# EAGLE design iss_camtag_v2_4 (EAGLE 9.4.2)
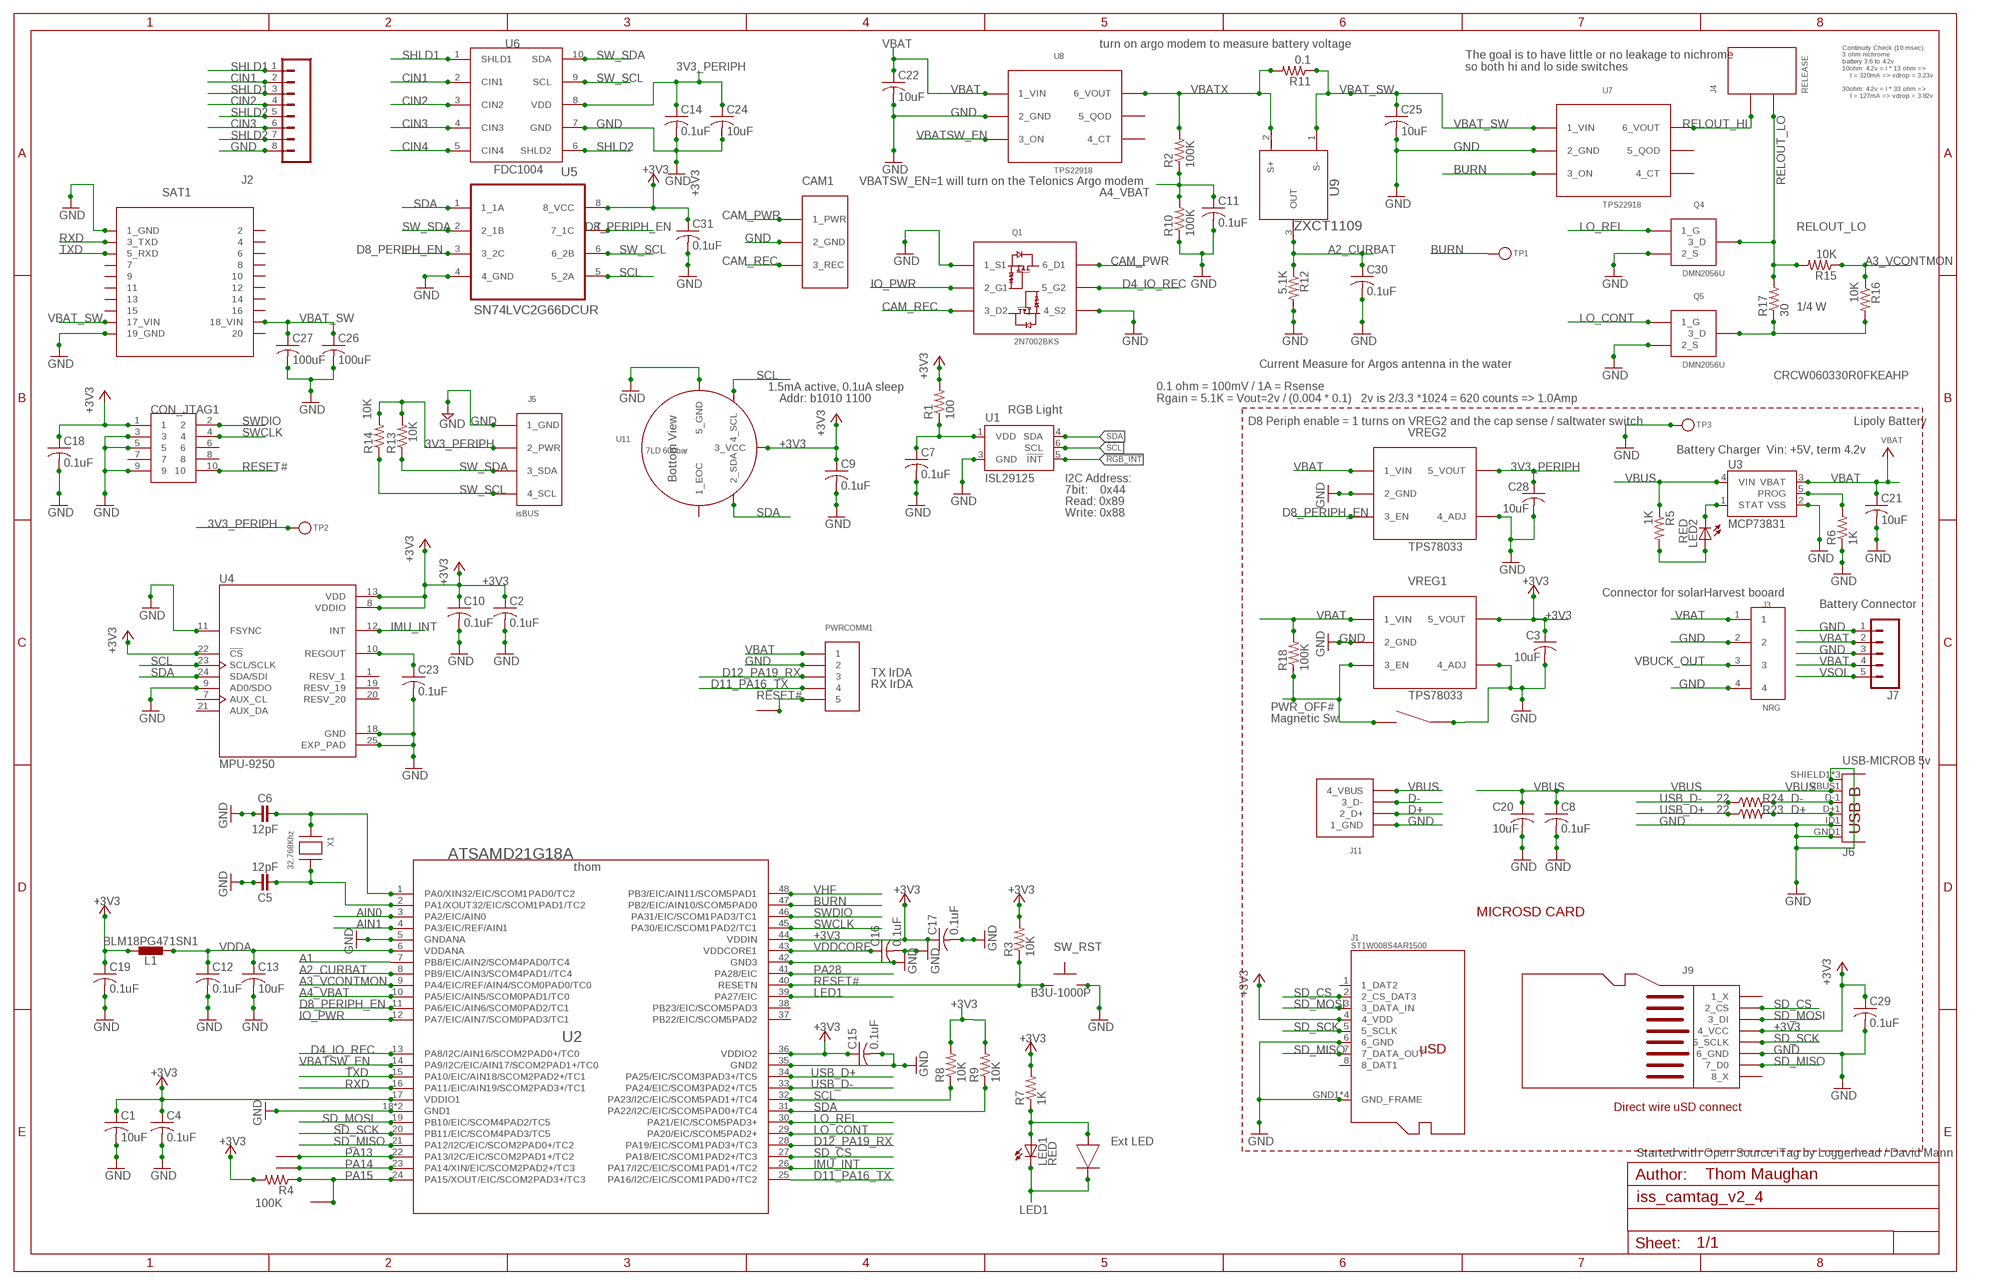
[diagram p0: schematic, sheet 1]

## Parts
C1  10uF  C-USC0603  [C0603]
C2  0.1uF  C-USC0402  [C0402]
C3  10uF  C-USC0603K  [C0603K]
C4  0.1uF  C-USC0402  [C0402]
C5  12pF  CAPACITORS-0402  [C0402]
C6  12pF  CAPACITORS-0402  [C0402]
C7  0.1uF  C-USC0402  [C0402]
C8  0.1uF  C-USC0402  [C0402]
C9  0.1uF  C-USC0402  [C0402]
C10  0.1uF  C-USC0402  [C0402]
C11  0.1uF  C-USC0402  [C0402]
C12  0.1uF  C-USC0402  [C0402]
C13  10uF  C-USC0603  [C0603]
C14  0.1uF  C-USC0402  [C0402]
C15  0.1uF  C-USC0402  [C0402]
C16  0.1uF  C-USC0402  [C0402]
C17  0.1uF  C-USC0402  [C0402]
C18  0.1uF  C-USC0402  [C0402]
C19  0.1uF  C-USC0402  [C0402]
C20  10uF  C-USC0603  [C0603]
C21  10uF  C-USC0603  [C0603]
C22  10uF  C-USC0603  [C0603]
C23  0.1uF  C-USC0402  [C0402]
C24  10uF  C-USC0603  [C0603]
C25  10uF  C-USC0603  [C0603]
C26  100uF  C-USC1210  [C1210]
C27  100uF  C-USC1210  [C1210]
C28  10uF  C-USC0603K  [C0603K]
C29  0.1uF  C-USC0402  [C0402]
C30  0.1uF  C-USC0402  [C0402]
C31  0.1uF  C-USC0402  [C0402]
CAM1  CON_1X3_CAMCTRL  [CON_1X3_CAMCTRL]
CON_JTAG1  HDR-SMT-50MIL/5X2  [HDR-SMT-50MIL/5X2]
J1  ST1W008S4AR1500  MICROSD_JAE_ST1W008S4AR1500  [MICROSD_JAE_ST1W008S4AR1500]
J2  CONN_08"  [1X08]
J3  NRG  CONNECTOR_1X4  [CONNECTOR_1X4_0_1]
J4  RELEASE  CON_1X2_0_1  [CON_1X2_0_1]
J5  isBUS  CON_ISBUS_0_1  [CON_1X4_0_1]
J6  USB-MICROB 5v  USB-MICROB"  [USB-B-MICRO-SMD_V03]
J7  M05PTH  [1X05]
J9  CON_8_MICROSD_WIRE  [CON_8_MICROSD_WIRE]
J11  CON_1X4_2MM_THRU  [CON_1X4_2MM_THRU]
L1  BLM18PG471SN1  INDUCTOR-0603  [C0603]
LED1  RED  LEDCHIPLED_0603  [CHIPLED_0603]
LED2  RED  LEDCHIPLED_0603  [CHIPLED_0603]
PWRCOMM1  CON_1X5_0_1  [CONNECTOR_1X5_0_1]
Q1  2N7002BKS  FET_N_DUAL_2N7002BKS  [SOT363]
Q4  DMN2056U  FET_A03414  [SOT23-3]
Q5  DMN2056U  FET_A03414  [SOT23-3]
R1  100  R-US_R0402  [R0402]
R2  100K  R-US_R0402  [R0402]
R3  10K  R-US_R0402  [R0402]
R4  100K  R-US_R0402  [R0402]
R5  1K  R-US_R0402  [R0402]
R6  1K  R-US_R0402  [R0402]
R7  1K  R-US_R0402  [R0402]
R8  10K  R-US_R0402  [R0402]
R9  10K  R-US_R0402  [R0402]
R10  100K  R-US_R0402  [R0402]
R11  0.1  R-US_R0603  [R0603]
R12  5.1K  R-US_R0402  [R0402]
R13  10K  R-US_R0402  [R0402]
R14  10K  R-US_R0402  [R0402]
R15  10K  R-US_R0402  [R0402]
R16  10K  R-US_R0402  [R0402]
R17  30  R-US_R0603  [R0603]
R18  100K  R-US_R0402  [R0402]
R23  22  R-US_R0402  [R0402]
R24  22  R-US_R0402  [R0402]
SAT1  TELONICS-ST-21H2-200A  [TELONICS_ST_21H2-200A]
SW_RST  B3U-1000P  [B3U-1000P]
TP1  TESTPOINTROUND1.5MM  [TESTPOINT_ROUND_1.5MM]
TP2  TESTPOINTROUND1.5MM  [TESTPOINT_ROUND_1.5MM]
TP3  TESTPOINTROUND1.5MM  [TESTPOINT_ROUND_1.5MM]
TP4  CON_1  [CON_1]
TP5  CON_1  [CON_1]
TP6  CON_1  [CON_1]
U1  ISL29125  [ODFN-LD-6]
U2  ATSAMD21G18A  [TQFN48_7MM]
U3  MCP73831  [SOT23-5]
U4  MPU-9250  MPU-9250-SNAP  [MPU-9250-FOOTPRINT]
U5  SN74LVC2G66DCUR  ANALOG_SW_SN74LVCG66DCUR  [ANALOG_SW_SN74LVCG66DCUR]
U6  FDC1004  [VSSOP-10]
U7  TPS22918  [SOT23-6]
U8  TPS22918  [SOT23-6]
U9  ZXCT1109  [SOT23]
U11  7LD 600bar  KELLER_7LD_PRESSURE  [KELLER_7LD]
U$3  CON_2_MAGSW  [CON_2_MAGSW]
U$4  CON_2_LED  [CON_2_LED]
U$5  CON_1  [CON_1]
VREG1  TPS78033  REG101  [SOT23-5]
VREG2  TPS78033  REG101  [SOT23-5]
X1  32.768Khz  XTAL_ABS06_32K  [XTAL_ABS06]

## Nets
3V3_PERIPH: C14.1 C24.1 C28.1 J5.P$2(2_PWR) R13.2 R14.2 TP2.P$1 U6.8(VDD) VREG2.P$5(5_VOUT)
!RGB_INT: U1.5(!INT)
+3V3: C1.1 C2.1 C3.1 C4.1 C9.1 C10.1 C15.1 C17.1 C18.1 C19.1 C29.1 C31.1 CON_JTAG1.1 J1.4(4_VDD) J9.4_VCC J9.P4(4_VCC) L1.2 R1.2 R3.2 R4.2 R7.2 R8.2 R9.2 U2.17(VDDIO1) U2.36(VDDIO2) U2.44(VDDIN) U4.8(VDDIO) U4.13(VDD) U4.22(!CS) U5.8(8_VCC) U11.3_VCC VREG1.P$5(5_VOUT)
A1: U2.7(PB8/EIC/AIN2/SCOM4PAD0/TC4)
A2_CURBAT: C30.1 R12.1 U2.8(PB9/EIC/AIN3/SCOM4PAD1//TC4) U9.3(OUT)
A3_VCONTMON: R15.1 R16.1 U2.9(PA4/EIC/REF/AIN4/SCOM0PAD0/TC0)
A4_VBAT: C11.1 R2.1 R10.2 U2.10(PA5/EIC/AIN5/SCOM0PAD1/TC0)
AIN0: U2.3(PA2/EIC/AIN0)
AIN1: U2.4(PA3/EIC/REF/AIN1)
BURN: TP1.P$1 U2.47(PB2/EIC/AIN10/SCOM5PAD0) U7.3(3_ON)
CAM_PWR: CAM1.1_PWR Q1.6(6_D1)
CAM_REC: CAM1.3_REC Q1.3(3_D2)
CIN1: J2.2 U6.2(CIN1)
CIN2: J2.4 U6.3(CIN2)
CIN3: J2.6 U6.4(CIN3)
CIN4: U6.5(CIN4)
D4_IO_REC: Q1.5(5_G2) U2.13(PA8/I2C/AIN16/SCOM2PAD0+/TC0)
D8_PERIPH_EN: U2.11(PA6/EIC/AIN6/SCOM0PAD2/TC1) U5.3(3_2C) U5.7(7_1C) VREG2.P$3(3_EN)
D11_PA16_TX: PWRCOMM1.4 U2.25(PA16/I2C/EIC/SCOM1PAD0+/TC2)
D12_PA19_RX: PWRCOMM1.3 U2.28(PA19/EIC/SCOM1PAD3+/TC3)
D+ [USBpair]: J6.D+1(D+) J11.P$2(2_D+) R23.2
D- [USBpair]: J6.D-1(D-) J11.P$3(3_D-) R24.2
GND [gnd]: C1.2 C2.2 C3.2 C4.2 C5.2 C6.1 C7.2 C8.2 C9.2 C10.2 C11.2 C12.2 C13.2 C14.2 C15.2 C16.2 C17.2 C18.2 C19.2 C20.2 C21.2 C22.2 C23.2 C24.2 C25.2 C26.2 C27.2 C28.2 C29.2 C30.2 C31.2 CAM1.2_GND CON_JTAG1.3 CON_JTAG1.5 CON_JTAG1.9 J1.6(6_GND) J1.GND1(GND_FRAME) J1.GND2(GND_FRAME) J1.GND3(GND_FRAME) J1.GND4(GND_FRAME) J2.8 J3.2 J3.4 J5.P$1(1_GND) J6.GND1(GND) J6.ID1(USBID) J6.SHIELD1(SHIELD) J6.SHIELD2(SHIELD) J6.SHIELD3(SHIELD) J7.1 J7.3 J9.6_GND J9.P6(6_GND) J11.P$1(1_GND) PWRCOMM1.2 Q1.1(1_S1) Q1.4(4_S2) Q4.2(2_S) Q5.2(2_S) R6.1 R10.1 R12.2 SAT1.1(1_GND) SAT1.19(19_GND) SAT1.21(1_GND) SAT1.39(19_GND) SW_RST.P$2 TP3.P$1 U1.3(GND) U2.5(GNDANA) U2.18(GND1) U2.35(GND2) U2.42(GND3) U2.THERMAL(GND1) U3.2(VSS) U4.9(AD0/SDO) U4.11(FSYNC) U4.18(GND) U4.25(EXP_PAD) U5.4(4_GND) U6.7(GND) U7.2(2_GND) U8.2(2_GND) U11.5_GND U$3.2 VREG1.P$2(2_GND) VREG1.P$4(4_ADJ) VREG2.P$2(2_GND) VREG2.P$4(4_ADJ)
IMU_INT: U2.26(PA17/I2C/EIC/SCOM1PAD1+/TC2) U4.12(INT)
IO_PWR: Q1.2(2_G1) U2.12(PA7/EIC/AIN7/SCOM0PAD3/TC1)
LAN: LED1.A R7.1 U$4.P$1(1A)
LED1: LED1.C U2.39(PA27/EIC) U$4.P$2(2K)
LO_CONT: Q5.1(1_G) U2.29(PA20/EIC/SCOM5PAD2+)
LO_REL: Q4.1(1_G) U2.30(PA21/EIC/SCOM5PAD3+)
N$1: C6.2 U2.1(PA0/XIN32/EIC/SCOM1PAD0/TC2) X1.P$1
N$2: LED2.C U3.1(STAT)
N$3: LED2.A R5.2
N$4: R6.2 U3.5(PROG)
N$7: C7.1 R1.1 U1.1(VDD)
N$8: C5.1 U2.2(PA1/XOUT32/EIC/SCOM1PAD1/TC2) X1.P$2
N$11: Q5.3(3_D) R16.2 R17.1
N$16: C23.1 U4.10(REGOUT)
PA13: TP4.P$1 U2.22(PA13/I2C/EIC/SCOM2PAD1+/TC2)
PA14: TP5.P$1 U2.23(PA14/XIN/EIC/SCOM2PAD2+/TC3)
PA15: R4.1 TP6.P$1 U2.24(PA15/XOUT/EIC/SCOM2PAD3+/TC3)
PA28: U2.41(PA28/EIC)
PWR_OFF#: R18.1 U$3.1 VREG1.P$3(3_EN)
RELOUT_HI: J4.P$1 U7.6(6_VOUT)
RELOUT_LO: J4.P$2 Q4.3(3_D) R15.2 R17.2
RESET#: CON_JTAG1.10 PWRCOMM1.5 R3.1 SW_RST.P$1 U2.40(RESETN) U$5.P$1
RXD: SAT1.3(3_TXD) SAT1.23(3_TXD) U2.16(PA11/EIC/AIN19/SCOM2PAD3+/TC1)
SCL: R8.1 U1.6(SCL) U2.32(PA23/I2C/EIC/SCOM5PAD1+/TC4) U4.23(SCL/SCLK) U5.5(5_2A) U11.4_SCL
SD_CS: J1.2(2_CS_DAT3) J9.2_CS J9.P2(2_CS) U2.27(PA18/EIC/SCOM1PAD2+/TC3)
SD_MISO: J1.7(7_DATA_OUT) J9.7_DO(7_D0) J9.P7(7_D0) U2.21(PA12/I2C/EIC/SCOM2PAD0+/TC2)
SD_MOSI: J1.3(3_DATA_IN) J9.3_DI J9.P3(3_DI) U2.19(PB10/EIC/SCOM4PAD2/TC5)
SD_SCK: J1.5(5_SCLK) J9.5_SCK(5_SCLK) J9.P5(5_SCLK) U2.20(PB11/EIC/SCOM4PAD3/TC5)
SDA: R9.1 U1.4(SDA) U2.31(PA22/I2C/EIC/SCOM5PAD0+/TC4) U4.24(SDA/SDI) U5.1(1_1A) U11.2_SDA
SHLD1: J2.1 J2.3 U6.1(SHLD1)
SHLD2: J2.5 J2.7 U6.6(SHLD2)
SW_SCL: J5.P$4(4_SCL) R14.1 U5.6(6_2B) U6.9(SCL)
SW_SDA: J5.P$3(3_SDA) R13.1 U5.2(2_1B) U6.10(SDA)
SWCLK: CON_JTAG1.4 U2.45(PA30/EIC/SCOM1PAD2/TC1)
SWDIO: CON_JTAG1.2 U2.46(PA31/EIC/SCOM1PAD3/TC1)
TXD: SAT1.5(5_RXD) SAT1.25(5_RXD) U2.15(PA10/EIC/AIN18/SCOM2PAD2+/TC1)
USB_D+ [USBpair]: R23.1 U2.34(PA25/EIC/SCOM3PAD3+/TC5)
USB_D- [USBpair]: R24.1 U2.33(PA24/EIC/SCOM3PAD2+/TC5)
VBAT: C21.1 C22.1 J3.1 J7.2 J7.4 PWRCOMM1.1 R18.2 U3.3(VBAT) U8.1(1_VIN) VREG1.P$1(1_VIN) VREG2.P$1(1_VIN)
VBAT_SW: C25.1 C26.1 C27.1 R11.1 SAT1.17(17_VIN) SAT1.18(18_VIN) SAT1.37(17_VIN) SAT1.38(18_VIN) U7.1(1_VIN) U9.1(S-)
VBATSW_EN: U2.14(PA9/I2C/EIC/AIN17/SCOM2PAD1+/TC0) U8.3(3_ON)
VBATX: R2.2 R11.2 U8.6(6_VOUT) U9.2(S+)
VBUCK_OUT: J3.3
VBUS: C8.1 C20.1 J6.VBUS1(VBUS) J11.P$4(4_VBUS) R5.1 U3.4(VIN)
VDDA: C12.1 C13.1 L1.1 U2.6(VDDANA)
VDDCORE: C16.1 U2.43(VDDCORE1)
VHF: U2.48(PB3/EIC/AIN11/SCOM5PAD1)
VSOL: J7.5
Unconnected: CON_JTAG1.6 CON_JTAG1.7 CON_JTAG1.8 J1.1(1_DAT2) J1.8(8_DAT1) J9.1_X J9.8_X J9.P1(1_X) J9.P8(8_X) SAT1.2 SAT1.4 SAT1.6 SAT1.7 SAT1.8 SAT1.9 SAT1.10 SAT1.11 SAT1.12 SAT1.13 SAT1.14 SAT1.15 SAT1.16 SAT1.20 SAT1.22 SAT1.24 SAT1.26 SAT1.27 SAT1.28 SAT1.29 SAT1.30 SAT1.31 SAT1.32 SAT1.33 SAT1.34 SAT1.35 SAT1.36 SAT1.40 U2.37(PB22/EIC/SCOM5PAD2) U2.38(PB23/EIC/SCOM5PAD3) U4.1(RESV_1) U4.7(AUX_CL) U4.19(RESV_19) U4.20(RESV_20) U4.21(AUX_DA) U7.4(4_CT) U7.5(5_QOD) U8.4(4_CT) U8.5(5_QOD) U11.1_EOC

## Notes on the sheet
- turn on argo modem to measure battery voltage
- The goal is to have little or no leakage to nichrome
  so both hi and lo side switches
- Continuity Check (10 msec)
  3 ohm nichrome
  battery 3.6 to 4.2v
  10ohm: 4.2v = I * 13 ohm =>
      I = 320mA => vdrop = 3.23v 
  
  30ohm: 4.2v = I * 33 ohm =>
      I = 127mA => vdrop = 3.82v
- VBATSW_EN=1 will turn on the Telonics Argo modem
- 1/4 W
- Current Measure for Argos antenna in the water
- CRCW060330R0FKEAHP
- 1.5mA active, 0.1uA sleep
- Addr: b1010 1100
- 0.1 ohm = 100mV / 1A = Rsense
  Rgain = 5.1K = Vout=2v / (0.004 * 0.1)   2v is 2/3.3 *1024 = 620 counts => 1.0Amp
- RGB Light
- D8 Periph enable = 1 turns on VREG2 and the cap sense / saltwater switch | Lipoly Battery
- Battery Charger  Vin: +5V, term 4.2v
- I2C Address:
- 7bit:    0x44
- Read: 0x89
- Write: 0x88
- Connector for solarHarvest booard
- Battery Connector
- TX IrDA
- RX IrDA
- Magnetic Sw
- MICROSD CARD
- Direct wire uSD connect
- Ext LED
- Started with Open Source iTag by Loggerhead / David Mann
- Thom Maughan

## Library data of the parts
C1 C2 C4 C7-C25 C29-C31 = iss_whalesharktag_v1_1:C-US: CAPACITOR, American symbol
C3 C26-C28 = iss_subg2cell_v3_0:C-US: CAPACITOR, American symbol
C5 C6 = iss_whalesharktag_v1_1:CAPACITORS: Capacitors ...4.7uF @ 6.3V -> 0402 ...10uF @ 16V -> 0603 ...22uF @ 25V -> 0805
CAM1 = thomz:CON_1X3_CAMCTRL
CON_JTAG1 = iss_whalesharktag_v1_1:HDR-SMT-50MIL/5X2
J1 = iss_whalesharktag_v1_1:MICROSD_JAE_ST1W008S4AR1500: JAE ST1W008S4AR1500
J2 = SparkFun-Connectors:CONN_08: Multi connection point. Often used as Generic Header-pin footprint for 0.1 inch spaced/style header connections On any of the 0.1 inch spaced packages, you can populate with these: Break Away Headers - Straight <https://www.sparkfun.com/products/116> (PRT-00116) Break Away Male Headers - Right Angle <https://www.sparkfun.com/products/553> (PRT-00553) Female Headers <https://www.sparkfun.com/products/115> (PRT-00115) Break Away Headers - Machine Pin <https://www.sparkfun.com/products/117> (PRT-00117) Break Away Female Headers - Swiss Machine Pin <https://www.sparkfun.com/products/743> (PRT-00743) Arduino Stackable Header - 8 Pin <https://www.sparkfun.com/products/9279> (PRT-09279) For SCREWTERMINALS and SPRING TERMINALS visit here: Screw Terimnals on SparkFun.com <https://www.sparkfun.com/search/results?term=Screw+Terminals> (5mm/3.5mm/2.54mm spacing) This device is also useful as a general connection point to wire up your design to another part of your project. Our various solder wires solder well into these plated through hole pads. Hook-Up Wire - Assortment (Stranded, 22 AWG) <https://www.sparkfun.com/products/11375> (PRT-11375) Hook-Up Wire - Assortment (Solid Core, 22 AWG) <https://www.sparkfun.com/products/11367> (PRT-11367) View the entire wire category on our website here <https://www.sparkfun.com/categories/141> Special notes: Molex polarized connector foot print use with SKU : PRT-08231 with associated crimp pins and housings. 1MM SMD Version SKU: PRT-10208 NOTES ON THE VARIANTS LOCK and LOCK_LONGPADS... This footprint was designed to help hold the alignment of a through-hole component (i.e. 6-pin header) while soldering it into place. You may notice that each hole has been shifted either up or down by 0.005 of an inch from it's more standard position (which is a perfectly straight line). This slight alteration caused the pins (the squares in the middle) to touch the edges of the holes. Because they are alternating, it causes a "brace" to hold the component in place. 0.005 has proven to be the perfect amount of "off-center" position when using our standard breakaway headers. Although looks a little odd when you look at the bare footprint, once you have a header in there, the alteration is very hard to notice. Also,if you push a header all the way into place, it is covered up entirely on the bottom side.; PROD_ID: CONN-08438
J3 = thomz:CONNECTOR_1X4
J4 = thomz:CON_1X2_0_1
J5 = iss_subg2cell_v3_0:CON_ISBUS_0_1
J6 = iss_subg2cell_v3_0:USB-MICROB; PROD_ID: CONN-11752
J7 = iss_whalesharktag_v1_1:M05: Header 5 Standard 5-pin 0.1" header. Use with straight break away headers (SKU : PRT-00116), right angle break away headers (PRT-00553), swiss pins (PRT-00743), machine pins (PRT-00117), and female headers (PRT-00115). Molex polarized connector foot print use with SKU : PRT-08230 with associated crimp pins and housings.
J9 = iss_whalesharktag_v1_1:CON_8_MICROSD_WIRE
J11 = iss_whalesharktag_v1_1:CON_1X4_2MM_THRU
L1 = iss_whalesharktag_v1_1:INDUCTOR: Inductors
LED1 LED2 = iss_whalesharktag_v1_1:LED: LED OSRAM: - CHIPLED LG R971, LG N971, LY N971, LG Q971, LY Q971, LO R971, LY R971 LH N974, LH R974 LS Q976, LO Q976, LY Q976 LO Q996 - Hyper CHIPLED LW Q18S LB Q993, LB Q99A, LB R99A - SideLED LS A670, LO A670, LY A670, LG A670, LP A670 LB A673, LV A673, LT A673, LW A673 LH A674 LY A675 LS A676, LA A676, LO A676, LY A676, LW A676 LS A679, LY A679, LG A679 - Hyper Micro SIDELED® LS Y876, LA Y876, LO Y876, LY Y876 LT Y87S - SmartLED LW L88C, LW L88S LB L89C, LB L89S, LG L890 LS L89K, LO L89K, LY L89K LS L896, LA L896, LO L896, LY L896 - TOPLED LS T670, LO T670, LY T670, LG T670, LP T670 LSG T670, LSP T670, LSY T670, LOP T670, LYG T670 LG T671, LOG T671, LSG T671 LB T673, LV T673, LT T673, LW T673 LH T674 LS T676, LA T676, LO T676, LY T676, LB T676, LH T676, LSB T676, LW T676 LB T67C, LV T67C, LT T67C, LS T67K, LO T67K, LY T67K, LW E67C LS E67B, LA E67B, LO E67B, LY E67B, LB E67C, LV E67C, LT E67C LW T67C LS T679, LY T679, LG T679 LS T770, LO T770, LY T770, LG T770, LP T770 LB T773, LV T773, LT T773, LW T773 LH T774 LS E675, LA E675, LY E675, LS T675 LS T776, LA T776, LO T776, LY T776, LB T776 LHGB T686 LT T68C, LB T68C - Hyper Mini TOPLED® LB M676 - Mini TOPLED Santana® LG M470 LS M47K, LO M47K, LY M47K Source: http://www.osram.convergy.de LUXEON: - LUMILED® LXK2-PW12-R00, LXK2-PW12-S00, LXK2-PW14-U00, LXK2-PW14-V00 LXK2-PM12-R00, LXK2-PM12-S00, LXK2-PM14-U00 LXK2-PE12-Q00, LXK2-PE12-R00, LXK2-PE12-S00, LXK2-PE14-T00, LXK2-PE14-U00 LXK2-PB12-K00, LXK2-PB12-L00, LXK2-PB12-M00, LXK2-PB14-N00, LXK2-PB14-P00, LXK2-PB14-Q00 LXK2-PR12-L00, LXK2-PR12-M00, LXK2-PR14-Q00, LXK2-PR14-R00 LXK2-PD12-Q00, LXK2-PD12-R00, LXK2-PD12-S00 LXK2-PH12-R00, LXK2-PH12-S00 LXK2-PL12-P00, LXK2-PL12-Q00, LXK2-PL12-R00 Source: www.luxeon.com KINGBRIGHT: KA-3528ASYC Source: www.kingbright.com
PWRCOMM1 = thomz:CON_1X5_0_1
Q1 = thomz:FET_N_DUAL_2N7002BKS
Q4 Q5 = thomz:FET_A03414
R1-R10 R12-R16 R18 R23 R24 = iss_whalesharktag_v1_1:R-US_: RESISTOR, American symbol
R11 R17 = resistor:R-US_: RESISTOR, American symbol
SAT1 = iss_whalesharktag_v1_1:TELONICS-ST-21H2-200A
SW_RST = iss_whalesharktag_v1_1:B3U-1000P
TP1-TP3 = iss_whalesharktag_v1_1:TESTPOINT: Test Point Various test points for characterisation and PCB testing TESTPOINT_SMT - Compact Surface Mount Test Point [Digikey: 5016KTR-ND]
TP4-TP6 U$5 = thomz:CON_1
U1 = iss_whalesharktag_v1_1:ISL29125: The ISL29125 is a low power, high sensitivity RGB color light sensor with an I2C interface.
U2 = iss_whalesharktag_v1_1:ATSAMD21G18A
U3 = iss_whalesharktag_v1_1:MCP73831: Microchip's MCP73831 Miniature single cell, fully integrated Li-Ion, Li-polymer charge management controller http://ww1.microchip.com/downloads/en/DeviceDoc/21984a.pdf
U4 = iss_whalesharktag_v1_1:MPU-9250-SNAP
U5 = thomz:ANALOG_SW_SN74LVCG66DCUR
U6 = circuitects:FDC1004
U7 U8 = iss_whalesharktag_v1_1:TPS22918
U9 = thomz:ZXCT1109
U11 = iss_whalesharktag_v1_1:KELLER_7LD_PRESSURE
U$3 = thomz:CON_2_MAGSW
U$4 = thomz:CON_2_LED
VREG1 VREG2 = iss_subg2cell_v3_0:REG101
X1 = iss_whalesharktag_v1_1:XTAL_ABS06_32K

## Net classes
1 USB: width 0.102 mm, drill 0.1 mm
2 gnd: width 0.102 mm, drill 0.1 mm
3 usbvcc: width 0.102 mm, drill 0.1 mm, clearance 0.15 mm
4 USBpair: width 0.102 mm, drill 0.1 mm, clearance 0.15 mm to class 3

## Board
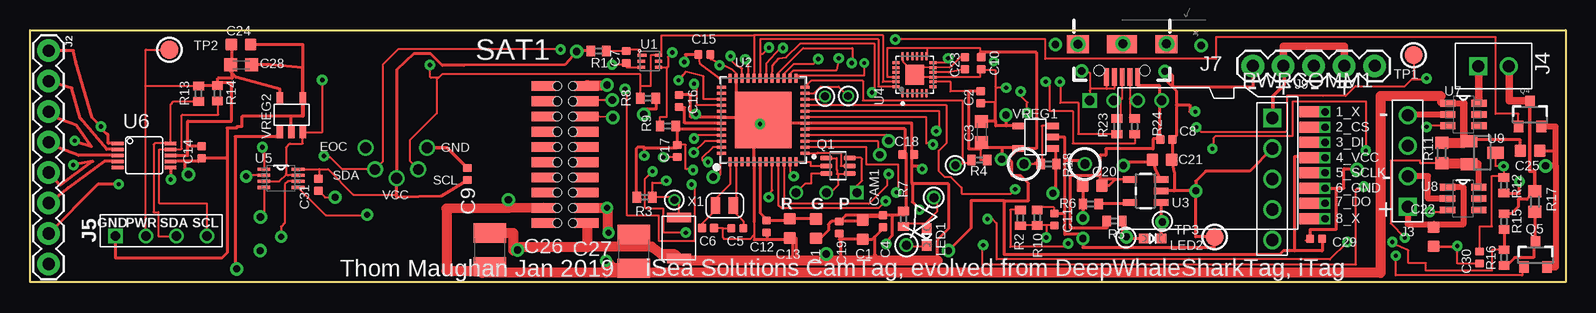
[diagram p1: board, top side]
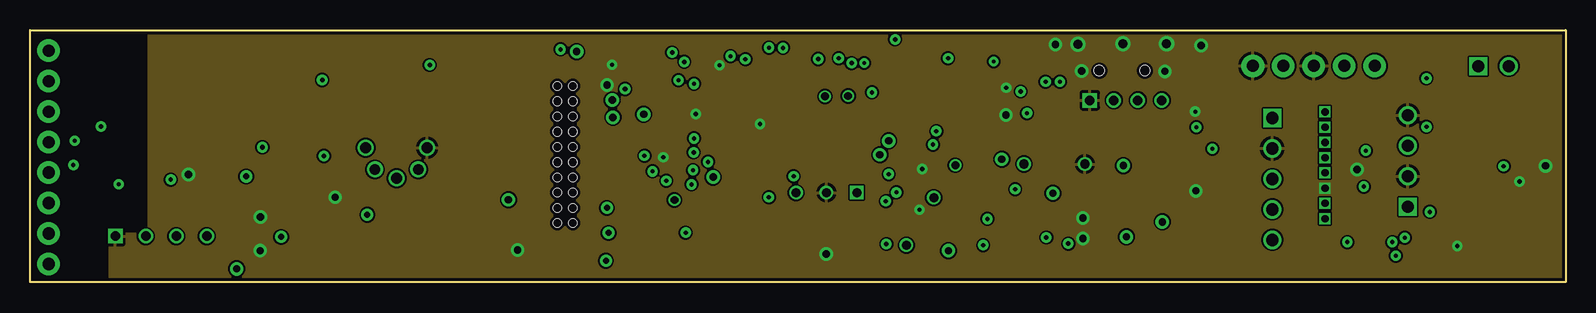
[diagram p2: board, inner layer Route2]
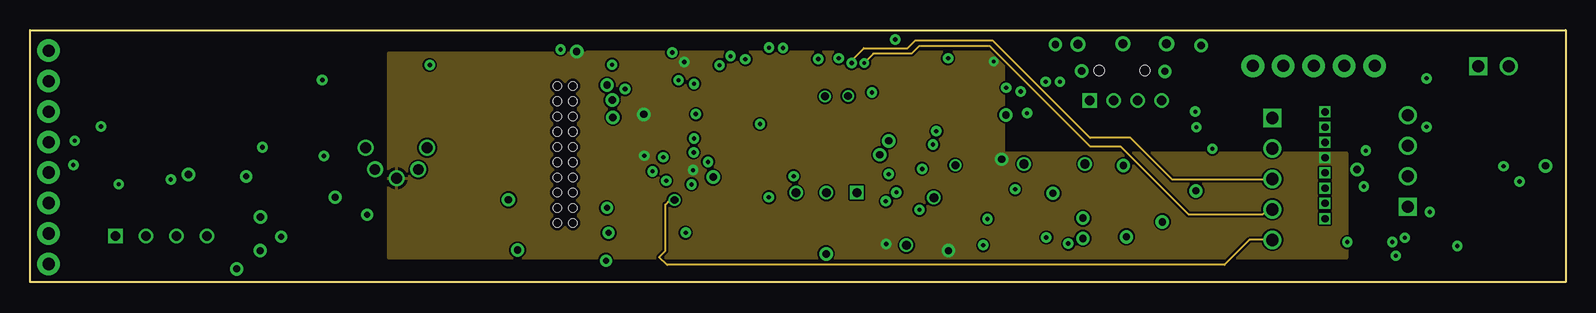
[diagram p3: board, inner layer Route15]
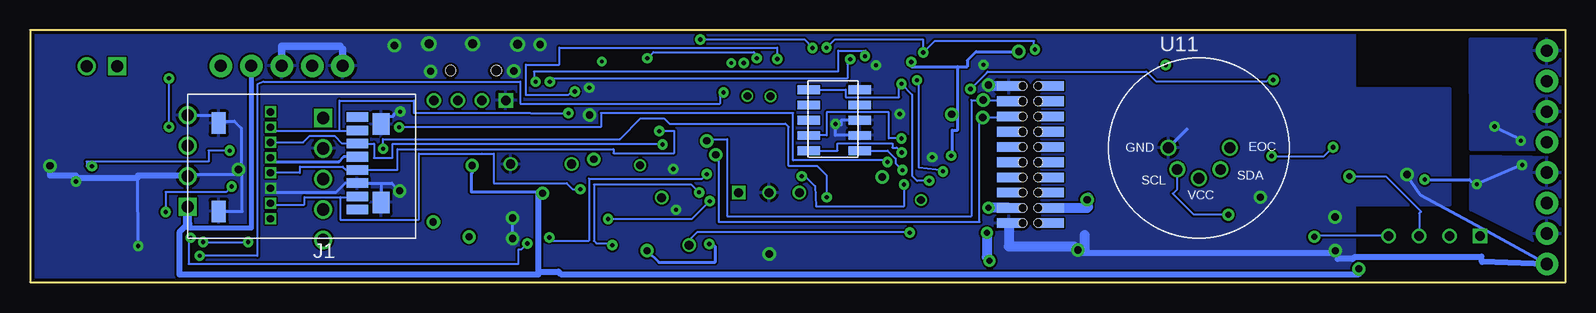
[diagram p4: board, bottom side, seen from below]

Size 128 x 21 mm. Coordinates in mm from the lower left corner, seen from the top.
Outline: 0,0 0,21 128,21 128,0 0,0
Copper layers (1*2*15*16): Top 0.035mm / dielectric 1.5mm / Route2 0.035mm / dielectric 0.15mm / Route15 0.035mm / dielectric 0.2mm / Bottom 0.035mm
Design rules "Circuitects-Rules *": minimum track width 6mil, minimum drill 0.3mm, track to track 6mil, track to pad 6mil, pad to pad 6mil, via to via 6mil, smd to smd 6mil, copper to edge 10mil, drill to drill 8mil, minimum pad ring 4mil, minimum via ring 10mil, stop-mask expansion 4mil, vias tented up to drill 25mil, thermal gap 10mil

### Footprints (pad centres in the part's own frame; a part is rotated, then mirrored left to right if it is on the bottom)
C0603 = smd 1 x 0.95: 1 0,0.8; 2 0,-0.8
C0402 = smd 0.75 x 0.7: 1 0,0.5; 2 0,-0.5
C0603K = smd 1.05 x 1.08: 1 -0.875,0; 2 0.875,0
C1210 = smd 1.6 x 2.7: 1 -1.4,0; 2 1.4,0
CON_1X3_CAMCTRL = drill 0.75 square: 1_PWR 0,2.54 | drill 0.75: 2_GND 0,0; 3_REC 0,-2.54
HDR-SMT-50MIL/5X2 = smd 0.74 x 1.85: 1 -2.54,-2.125; 2 -2.54,2.125; 3 -1.27,-2.125; 4 -1.27,2.125; 5 0,-2.125; 6 0,2.125; 7 1.27,-2.125; 8 1.27,2.125; 9 2.54,-2.125; 10 2.54,2.125
MICROSD_JAE_ST1W008S4AR1500 = smd 1.8 x 0.8: 1 -11.55,0; 2 -11.55,1.1; 3 -11.55,2.2; 4 -11.55,3.3; 5 -11.55,4.4; 6 -11.55,5.5; 7 -11.55,6.6; 8 -11.55,7.7 | smd 1.2 x 1.8: GND1 0,0.5; GND2 0,7.85 | smd 1.4 x 1.8: GND3 -13.55,0.58; GND4 -13.55,7.1
1X08 = drill 1.016 pad 1.88: 1 0,0; 2 2.54,0; 3 5.08,0; 4 7.62,0; 5 10.16,0; 6 12.7,0; 7 15.24,0; 8 17.78,0
CONNECTOR_1X4_0_1 = drill 1.016 square: 1 0,0 | drill 1.016: 2 0,-2.54; 3 0,-5.08; 4 0,-7.62
CON_1X2_0_1 = drill 1 square: P$1 0,1.27 | drill 1: P$2 0,-1.27
CON_1X4_0_1 = drill 0.8 square: P$1 0,3.81 | drill 0.8: P$2 0,1.27; P$3 0,-1.27; P$4 0,-3.81
USB-B-MICRO-SMD_V03 = smd 1.45 x 0.4: D+1 2.725,0; D-1 2.725,0.65; GND1 2.725,-1.3; ID1 2.725,-0.65; VBUS1 2.725,1.3 | smd 1.5 x 1.8: SHIELD1 0,3.685; SHIELD2 0,-3.685 | smd 1.5 x 2.5: SHIELD3 0,0 | hole 0.85: 2.2,1.9; 2.2,-1.9
1X05 = drill 1.016 pad 1.88: 1 0,0; 2 2.54,0; 3 5.08,0; 4 7.62,0; 5 10.16,0
CON_8_MICROSD_WIRE = drill 0.6 pad 0.914 square: 1_X 0,4.445; 2_CS 0,3.175; 3_DI 0,1.905; 4_VCC 0,0.635; 5_SCK 0,-0.635; 6_GND 0,-1.905; 7_DO 0,-3.175; 8_X 0,-4.445 | smd 2.032 x 0.914: P1 -1.143,4.445; P2 -1.143,3.175; P3 -1.143,1.905; P4 -1.143,0.635; P5 -1.143,-0.635; P6 -1.143,-1.905; P7 -1.143,-3.175; P8 -1.143,-4.445
CON_1X4_2MM_THRU = drill 0.8 square: P$1 0,3 | drill 0.8: P$2 0,1; P$3 0,-1; P$4 0,-3
CHIPLED_0603 = smd 0.8 x 0.8: A 0,-0.75; C 0,0.75
CONNECTOR_1X5_0_1 = drill 1.016 square: 1 0,5.08 | drill 1.016: 2 0,2.54; 3 0,0; 4 0,-2.54; 5 0,-5.08
SOT363 = smd 0.99 x 0.41: 1 -0.97,0.65; 2 -0.97,0; 3 -0.97,-0.65; 4 0.97,-0.65; 5 0.97,0; 6 0.97,0.65
SOT23-3 = smd 0.8 x 0.95: 1 -0.95,-1; 2 0.95,-1; 3 0,1.1
R0402 = smd 0.7 x 0.9: 1 -0.65,0; 2 0.65,0
R0603 = smd 1 x 1.1: 1 -0.85,0; 2 0.85,0
TELONICS_ST_21H2-200A = smd 2 x 0.8: 1 -2.032,13.97; 2 -5.588,13.97; 3 -2.032,12.7; 4 -5.588,12.7; 5 -2.032,11.43; 6 -5.588,11.43; 7 -2.032,10.16; 8 -5.588,10.16; 9 -2.032,8.89; 10 -5.588,8.89; 11 -2.032,7.62; 12 -5.588,7.62; 13 -2.032,6.35; 14 -5.588,6.35; 15 -2.032,5.08; 16 -5.588,5.08; 17 -2.032,3.81; 18 -5.588,3.81; 19 -2.032,2.54; 20 -5.588,2.54 | smd 2 x 0.8 bottom: 21 -2.032,13.97; 22 -5.588,13.97; 23 -2.032,12.7; 24 -5.588,12.7; 25 -2.032,11.43; 26 -5.588,11.43; 27 -2.032,10.16; 28 -5.588,10.16; 29 -2.032,8.89; 30 -5.588,8.89; 31 -2.032,7.62; 32 -5.588,7.62; 33 -2.032,6.35; 34 -5.588,6.35; 35 -2.032,5.08; 36 -5.588,5.08; 37 -2.032,3.81; 38 -5.588,3.81; 39 -2.032,2.54; 40 -5.588,2.54 | hole 0.7: -3.175,2.54; -3.175,3.81; -3.175,5.08; -3.175,6.35; -3.175,7.62; -3.175,8.89; -3.175,10.16; -3.175,11.43; -3.175,12.7; -3.175,13.97; -4.445,13.97; -4.445,12.7; -4.445,11.43; -4.445,10.16; -4.445,8.89; -4.445,7.62; -4.445,6.35; -4.445,5.08; -4.445,3.81; -4.445,2.54
B3U-1000P = smd 0.8 x 2: P$1 -1.7,0; P$2 1.7,0
TESTPOINT_ROUND_1.5MM = smd 1.5 x 1.5: P$1 0,0
CON_1 = drill 0.65: P$1 0,0
ODFN-LD-6 = smd 0.75 x 0.25: 1 -0.645,0.5 | smd 0.6 x 0.25: 2 -0.72,0; 3 -0.72,-0.5; 4 0.72,-0.5; 5 0.72,0; 6 0.72,0.5
TQFN48_7MM = smd 0.25 x 0.75: 1 -2.75,-3.475; 2 -2.25,-3.475; 3 -1.75,-3.475; 4 -1.25,-3.475; 5 -0.75,-3.475; 6 -0.25,-3.475; 7 0.25,-3.475; 8 0.75,-3.475; 9 1.25,-3.475; 10 1.75,-3.475; 11 2.25,-3.475; 12 2.75,-3.475; 25 2.75,3.475; 26 2.25,3.475; 27 1.75,3.475; 28 1.25,3.475; 29 0.75,3.475; 30 0.25,3.475; 31 -0.25,3.475; 32 -0.75,3.475; 33 -1.25,3.475; 34 -1.75,3.475; 35 -2.25,3.475; 36 -2.75,3.475 | smd 0.75 x 0.25: 13 3.475,-2.75; 14 3.475,-2.25; 15 3.475,-1.75; 16 3.475,-1.25; 17 3.475,-0.75; 18 3.475,-0.25; 19 3.475,0.25; 20 3.475,0.75; 21 3.475,1.25; 22 3.475,1.75; 23 3.475,2.25; 24 3.475,2.75; 37 -3.475,2.75; 38 -3.475,2.25; 39 -3.475,1.75; 40 -3.475,1.25; 41 -3.475,0.75; 42 -3.475,0.25; 43 -3.475,-0.25; 44 -3.475,-0.75; 45 -3.475,-1.25; 46 -3.475,-1.75; 47 -3.475,-2.25; 48 -3.475,-2.75 | smd 4.7 x 4.7: THERMAL 0,0
SOT23-5 = smd 0.55 x 1.2: 1 -0.95,-1.3; 2 0,-1.3; 3 0.95,-1.3; 4 0.95,1.3; 5 -0.95,1.3
MPU-9250-FOOTPRINT = smd 0.64 x 0.22: 1 -1.545,1; 2 -1.545,0.6; 3 -1.545,0.2; 4 -1.545,-0.2; 5 -1.545,-0.6; 6 -1.545,-1; 13 1.545,-1; 14 1.545,-0.6; 15 1.545,-0.2; 16 1.545,0.2; 17 1.545,0.6; 18 1.545,1 | smd 0.22 x 0.64: 7 -1,-1.545; 8 -0.6,-1.545; 9 -0.2,-1.545; 10 0.2,-1.545; 11 0.6,-1.545; 12 1,-1.545; 19 1,1.545; 20 0.6,1.545; 21 0.2,1.545; 22 -0.2,1.545; 23 -0.6,1.545; 24 -1,1.545 | smd 1.7 x 1.54: 25 0,0
ANALOG_SW_SN74LVCG66DCUR = smd 1.067 x 0.254: 1 -1.422,0.762; 2 -1.422,0.254; 3 -1.422,-0.254; 4 -1.422,-0.762; 5 1.422,-0.762; 6 1.422,-0.254; 7 1.422,0.254; 8 1.422,0.762
VSSOP-10 = smd 0.27 x 0.975: 1 -1,-2.2; 2 -0.5,-2.2; 3 0,-2.2; 4 0.5,-2.2; 5 1,-2.2; 6 1,2.2; 7 0.5,2.2; 8 0,2.2; 9 -0.5,2.2; 10 -1,2.2
SOT23-6 = smd 1.27 x 0.559: 1 -1.295,0.94; 2 -1.295,0; 3 -1.295,-0.94; 4 1.295,-0.94; 5 1.295,0; 6 1.295,0.94
SOT23 = smd 1 x 1.4: 1 -0.95,-1.1; 2 0.95,-1.1; 3 0,1.1
KELLER_7LD = drill 0.889 pad 1.27: 1_EOC 2.58,0; 2_SDA 1.8,-1.8; 3_VCC 0,-2.54; 4_SCL -1.8,-1.8; 5_GND -2.54,0
CON_2_MAGSW = drill 0.762: 1 -2.54,0; 2 2.54,0
CON_2_LED = drill 0.75: P$1 -1.016,0; P$2 3.556,0
SOT23-5' = smd 1 x 0.54: P$1 -1.431,0.95; P$2 -1.431,0; P$3 -1.431,-0.95; P$4 1.419,-0.95; P$5 1.419,0.95
XTAL_ABS06 = smd 0.762 x 1.397: P$1 0.737,0; P$2 -0.737,0

### Placement (x,y rotation side)
C1  69.42,4.37 0 top
C2  79.25,15.39 0 top
C3  79.33,12.5 90 top
C4  71.1,5.05 0 top
C5  58.96,4.48 270 top
C6  56.51,4.5 270 top
C7  49.71,18.75 0 top
C8  94.72,11.86 90 top
C9  36.47,8.99 180 top
C10  79.28,18.24 0 top
C11  85.4,5.21 180 top
C12  61.4,4.62 0 top
C13  63.33,4.47 0 top
C14  14.32,10.81 0 top
C15  56.22,18.95 90 top
C16  54.11,15.09 180 top
C17  53.96,10.92 0 top
C18  73.21,10.62 90 top
C19  67.47,4.55 0 top
C20  88.55,8.03 270 top
C21  94.37,10.19 90 top
C22  117,3.77 0 top
C23  77.93,18.24 180 top
C24  17.6,19.79 90 top
C25  125.04,10.93 90 top
C26  38.34,2.68 90 top
C27  50.34,2.56 90 top
C28  17.61,18.09 0 top
C29  107.22,3.61 270 top
C30  120.83,2.03 0 top
C31  24.05,8.1 0 top
CAM1  66.4,7.44 270 top
CON_JTAG1  60.96,13.48 90 bottom
J1  112.27,13.74 180 bottom
J2  1.56,19.28 270 top
J3  114.85,6.28 180 top
J4  122,18 90 top
J5  10.93,3.82 90 top
J6  91.04,19.81 270 top
J7  101.94,18.01 0 top
J9  107.96,9.73 0 top
J11  91.34,15.14 90 top
L1  65.52,4.45 0 top
LED1  74.75,3.74 180 top
LED2  93.57,3.62 270 top
PWRCOMM1  103.56,8.59 0 top
Q1  67.36,9.68 0 top
Q4  125.03,13.94 0 top
Q5  125.5,2.23 0 top
R1  47.4,19.25 180 top
R2  82.56,5.33 90 top
R3  51.24,7.06 180 top
R4  79.13,10.17 0 top
R5  90.41,5.08 0 top
R6  88.42,6.5 0 top
R7  72.81,5.26 90 top
R8  51.52,15.32 0 top
R9  53.17,13 0 top
R10  83.95,5.36 270 top
R11  117.68,10.74 270 top
R12  122.87,8.05 270 top
R13  14.05,15.7 90 top
R14  15.63,15.72 90 top
R15  122.88,5.04 90 top
R16  122.88,2.04 270 top
R17  125.45,6.7 90 top
R18  84.91,9.83 0 top
R23  90.61,12.96 90 top
R24  92.09,12.96 90 top
SAT1  48.42,2.36 0 top
SW_RST  54.09,3.67 270 top
TP1  115.35,18.9 270 top
TP2  11.61,19.35 0 top
TP3  98.76,3.76 180 top
TP4  66.27,15.47 0 top
TP5  68.2,15.49 0 top
TP6  77.14,9.73 0 top
U1  51.67,18.41 0 top
U2  61.12,13.49 0 top
U3  92.99,7.59 90 top
U4  73.74,17.27 90 top
U5  20.93,8.64 0 top
U6  9.52,10.55 270 top
U7  119.49,13.96 0 top
U8  119.47,6.95 0 top
U9  121.07,10.77 270 top
U11  30.56,11.19 0 bottom
U$3  85.39,9.83 0 top
U$4  74.83,6.15 240 top
U$5  53.72,6.83 0 top
VREG1  TPS78033  [SOT23-5']  83.83,12.06 180 top
VREG2  TPS78033  [SOT23-5']  21.79,13.91 90 top
X1  57.89,6.38 180 top

### Tracks (layer width: path | path; a pad name or v marks a point on that pad's centre or on a via)
3V3_PERIPH
  Top 0.178: J5.P$2 9.66,16.35 | 9.66,16.35 R13.2 | 9.66,16.35 9.66,19.36 TP2.P$1
  Top 0.254: 16.84,16.97 C28.1 16.73,17.51 17.18,17.06 20.84,16.07 VREG2.P$5 | 16.84,16.97 15.65,16.97 15.65,16.59 | 15.65,16.59 16.8,16.59 16.8,13.41 13.16,13.41 13.16,11.33 | 15.65,16.59 15.63,16.59 R14.2 14.08,16.37 R13.2 | U6.8 13.16,10.55 13.16,11.33 | C24.1 16.8,17.02 16.84,16.97 | C14.1 14.32,11.33 13.16,11.33
+3V3  (via drill 0.3, 0.35, 0.6)
  Top 0.178: C1.1 69.32,5.28 69.09,5.05 | U2.36 57.42,16.96 55.82,18.19 55.74,18.74 C15.1 | C2.1 76.71,15.89 76.71,16.69 75.29,16.69 U4.8 | C10.1 79.28,18.8 79.2,18.87 79.2,19.49 74.76,19.49 | 74.76,19.49 71.46,19.49 71.46,17.07 U4.22 | U4.13 74.76,18.82 74.76,19.49 | 107.96,10.46 J9.4_VCC J9.P4 | R4.2 79.23,10.17 79.23,11.07 79.23,11.18 | C17.1 54.66,11.42 54.66,9.41 55.28,9.41 v55.28,9.32 | C3.1 79.33,11.07 79.18,11.07 | R8.2 52.17,15.29 52.19,15.29 | R7.2 73.03,5.69 73.03,5.58 | C4.1 71.1,5.45 | U5.8 24.13,9.4 | 24.13,9.4 24.84,9.4 26.95,7.29 30.56,7.29 | C31.1 24.13,8.68 24.13,9.4
  Top 0.254: U2.17 64.61,12.75 72.93,12.75 72.93,10.72 | 71.1,5.45 69.71,5.45 C1.1 | 69.09,5.05 C19.1 | 71.89,5.58 73.03,5.58 73.03,10.72 72.93,10.72 | 71.89,5.58 68,5.58 C19.1 | L1.2 65.91,3.65 66.55,4.29 66.55,4.78 66.83,5.05 C19.1 | 51.21,11.2 53.96,11.2 53.96,11.23 | 53.96,11.23 C17.1 53.96,12.74 | 52.19,15.29 52.19,14.4 51.22,14.4 v51.16,13.97 | R1.2 45.52,19.25 45.52,19.23 45.55,19.23 v45.57,19.2 44.6,18.11 36.17,18.06 34.36,18.06 33.41,19.01 31.98,19.01 30.58,17.7 U11.3_VCC 30.56,7.29 30.56,7.06 34.29,7.16 C9.1 | U2.44 53.96,12.74 | 53.98,11.23 53.96,11.23 | R3.2 50.53,7.06 50.53,11.12 50.63,11.23 51.21,11.23 51.21,11.2 | VREG1.P$5 82.41,11.18 81.01,11.18 | 81.01,11.18 79.23,11.18 | 79.23,11.07 79.18,11.07 78.24,11.07 78.24,15.89 C2.1 | VREG1.P$5 83.88,11.12 83.88,19.13 79.2,19.13 79.2,18.87 | 53.96,12.74 53.82,12.74 R9.2 | 105.42,2.59 105.42,10.46 107.96,10.46 | C29.1 107.72,2.59 105.42,2.59 | 105.42,2.59 104.48,2.59 104.2,2.31 81.2,2.31 81.2,6.78 | 81.2,6.78 83.24,6.78 83.24,8.22 82.6,8.87 81.86,8.87 81.84,8.89 81.84,10.01 81.61,10.24 | 81.2,6.78 78.44,6.78 78.44,4.5 v76.56,2.62 | v71.38,3.17 71.38,3.37 71.89,3.88 71.89,5.58 | 81.01,11.18 v81.01,10.24 81.61,10.24 | C18.1 72.71,10.72 72.93,10.72 | C15.1 54.64,18.95 54.64,18.34 v54.54,18.34 | v51.21,10.52 51.21,11.2 | 81.61,10.24 81.61,10.32 VREG1.P$5
  Bottom 0.178: v55.28,9.32 55.85,9.9 55.85,10.29 56.51,10.94 CON_JTAG1.1
  Bottom 0.254: v45.57,19.2 49.13,19.2 49.87,18.47 49.87,17.96 50.68,17.96 | J1.4 101.84,10.44 102.24,10.04 107.63,10.04 J9.4_VCC | v76.56,2.62 75.57,1.63 70.9,1.63 70.9,2.99 71.08,3.17 v71.38,3.17 | v54.54,18.34 54.54,17.96 50.68,17.96 | 50.68,17.96 50.68,13.97 | 50.68,13.97 50.68,12.65 51.14,12.65 51.14,10.46 51.21,10.46 v51.21,10.52 | v51.16,13.97 50.68,13.97
  other vias: 80.34,18.36
  pour Route15: 46.3,19.05 29.85,19.05 29.85,2.03 109.8,2.03 109.8,10.72 81.2,10.72 81.2,19.15 46.41,19.15
A2_CURBAT  (via drill 0.35)
  Top 0.178: U2.8 61.87,7.65 61.59,7.37 v61.59,7.06 | v98.56,11.1 98.64,11.18 98.64,11.97 98.82,12.16 105.24,12.16 105.24,15.06 111.36,15.06 v111.36,10.95 | U9.3 122.17,9.68 122.84,9.68 v122.84,9.65 122.84,8.84 | C30.1 120.83,4.63 121.87,4.63 121.87,8.84 122.84,8.84 | R12.1 122.87,8.84 122.84,8.84
  Bottom 0.178: v61.59,7.06 61.59,8.89 62.38,9.68 64.75,9.68 64.75,12.93 65.03,13.21 74.71,13.21 75.14,13.64 77.09,13.64 78.82,11.91 98.58,11.91 98.58,11.12 v98.56,11.1 | v111.36,10.95 113.11,10.95 113.11,10.03 123.27,10.03 123.27,9.65 v122.84,9.65
A3_VCONTMON  (via drill 0.35)
  Top 0.178: R16.1 121.87,2.69 121.87,0.94 116.36,0.94 116.36,1.57 114.91,1.57 114.91,2.64 113.64,3.2 113.61,3.48 v113.57,3.33 | v109.8,3.33 108.37,1.89 80.57,1.89 80.57,4.9 80.24,5.23 79.81,5.23 v79.81,5.26 | U2.9 62.37,6.41 62.64,6.15 70.75,6.15 v71.34,6.74
  Top 0.254: R15.1 R16.1
  Bottom 0.178: v113.57,3.33 109.8,3.3 v109.8,3.33 | v71.34,6.74 72.82,5.26 v79.81,5.26
A4_VBAT  (via drill 0.35)
  Top 0.178: U2.10 62.87,6.5 69.93,6.5 71.46,8.03 71.46,8.87 v71.58,8.99 | R2.1 82.56,4.71 R10.2 84.72,4.71 | 84.72,4.71 C11.1 | 84.72,4.71 v84.72,3.71
  Bottom 0.178: v71.58,8.99 71.97,8.61 81.41,8.61 81.41,3.45 84.67,3.45 84.67,3.71 v84.72,3.71
BURN  (via drill 0.35)
  Top 0.178: U7.3 116.57,13.02 116.57,12.93 v116.42,12.93 | U2.47 56.93,11.24 56.04,10.35 56.04,10.16 56.37,10.16 v56.52,10.01 | v97.24,12.9 97.64,12.5 104.64,12.5 104.8,12.66 104.8,15.54 107.75,15.54 107.77,15.52 109.68,15.52 110.5,16.33 114.61,16.33 115.17,16.89 115.35,16.89 | 115.35,16.89 116.36,16.89 116.36,16.92 v116.42,16.97 | TP1.P$1 115.35,16.89
  Bottom 0.178: v116.42,12.93 v116.42,16.97 | v56.52,10.01 56.52,10.13 64.38,10.13 64.38,14.1 80.41,14.1 80.41,12.93 97.21,12.93 v97.24,12.9
CAM_PWR
  Top 0.178: Q1.6 69.29,10.34 69.37,10.26 69.37,8.46 68.94,8.03 CAM1.1_PWR
CAM_REC
  Top 0.178: Q1.3 65.11,9.03 65.11,8.2 64.62,8.2 CAM1.3_REC
CIN1
  Top 0.254: U6.2 6.38,11.05 4.17,13.64 3.49,16.15 J2.2
CIN2
  Top 0.254: U6.3 4.03,10.55 2.01,11.33 J2.4
CIN3
  Top 0.254: U6.4 6.18,10.06 3.18,7.87 J2.6
D4_IO_REC
  Top 0.178: U2.13 65.65,10.74 65.65,10.77 67.59,10.77 67.59,9.68 Q1.5
D8_PERIPH_EN  (via drill 0.35, 0.38)
  Top 0.178: U2.11 63.37,9.17 63.47,9 v63.66,8.81 | v55.15,8.13 55.38,7.9 55.38,3.4 52.43,3.4 52.43,5.54 49.78,5.54 49.78,16.31 49.61,16.31 v49.61,16.08 | v24.36,16.84 24.36,12.5 24.33,12.48 VREG2.P$3 22.74,11.56 22.71,11.53 21.67,11.53 21.34,11.2 21.34,9.04 | U5.7 21.49,8.89 21.34,9.04 | U5.3 20.78,8.38 21.34,8.94 21.34,9.04
  Bottom 0.178: v63.66,8.81 63.38,8.81 62.55,7.98 62.47,6.3 55.15,6.3 v55.15,8.13 | v49.61,16.08 48.24,17.44 48.16,17.53 34.95,17.53 34.16,16.74 24.89,16.74 24.54,17.09 24.36,16.92 v24.36,16.84
D11_PA16_TX  (via drill 0.3)
  Top 0.178: U2.25 64.1,17.19 69.55,17.19 v69.55,18.26
  Route15 0.178: v69.55,18.26 70.31,19.02 73.48,19.02 74.12,19.66 80.01,19.66 88.39,11.28 90.93,11.28 96.6,5.61 102.72,5.61 103.15,6.04 PWRCOMM1.4
D12_PA19_RX  (via drill 0.35)
  Top 0.178: U2.28 62.37,17.41 64.44,19.48 68.56,19.48 68.56,18.41 68.54,18.4 68.54,18.3 v68.49,18.25
  Route15 0.152: PWRCOMM1.3 103.48,8.66 103.38,8.56
  Route15 0.178: v68.49,18.25 68.48,18.24 68.48,18.44 69.52,19.48 73.15,19.48 73.81,20.14 80.24,20.14 88.37,12.01 91.75,12.01 95.2,8.56 103.38,8.56
D+
  Top 0.178: 90.89,15.27 90.89,13.84 90.84,13.84 R23.2 | J11.P$2 90.34,15.27 90.89,15.27 | 90.89,15.27 91.03,15.27 91.04,15.27 J6.D+1
D-
  Top 0.178: 91.68,15.24 91.68,16.2 91.69,16.21 J6.D-1 | 91.68,15.24 91.68,13.69 91.89,13.69 92.09,13.89 R24.2 | J11.P$3 92.34,15.24 91.68,15.24
GND  (via drill 0.35, 0.6, 0.75)
  Top 0.178: 60.37,5.01 60.36,5 60.36,3.94 | 60.38,13.61 U2.THERMAL | 59.16,13.74 U2.THERMAL | 60.36,3.94 60.36,3.5 | 60.36,3.94 60,3.58 57.89,3.58 57.77,3.71 57.77,4.47 | 57.77,4.47 57.77,4.48 C5.2 | 57.77,4.47 57.05,4.47 C6.1 | 63.16,3.5 C13.2 63.49,3.67 | 61.42,4.1 C12.2 | 63.49,3.67 63.35,3.53 | 63.76,3.94 63.49,3.67 | U1.3 49.71,17.91 C7.2 49.71,18.11 v48.52,18.11 | C15.2 56.72,18.61 56.76,18.56 58.58,17.68 58.87,17.39 U2.35 | C11.2 85.35,5.71 85.35,6.22 83.95,6.22 R10.1 | 95.22,10.32 95.22,10.13 | C10.2 79.28,17.65 | C2.2 79.25,14.99 80.45,14.99 80.47,14.99 80.47,16.3 | 79.28,17.65 80.47,17.65 80.47,16.3 | 79.28,17.65 79.2,17.65 79.2,17.07 U4.9 73.74,17.07 U4.25 | U4.18 72.74,18.46 72.78,18.41 72.78,18.36 73.24,17.88 | U4.25 73.74,17.35 73.7,17.39 | 73.7,17.39 73.24,17.88 | C29.2 106.5,3.61 106.34,3.45 106.47,3.45 106.56,3.54 | 107.96,7.85 J9.6_GND J9.P6 | 75.65,1.8 75.65,3.51 | 88.34,15.98 J11.P$1 | 88.34,15.98 88.34,17.45 87.83,17.45 | C23.2 77.58,18.74 76.81,17.97 76.8,17.97 76.67,17.88 U4.11 74.56,17.88 73.7,17.39 | J6.ID1 90.39,16.14 90.35,16.1 89.77,16.1 | 89.77,16.1 88.47,16.1 88.34,15.98 | J6.GND1 89.74,16.13 89.77,16.1 | C17.2 53.96,10.39 v52.79,10.39 | J6.SHIELD2 | v91.09,19.84 91.04,19.84 J6.SHIELD3 | J6.SHIELD1 94.72,19.84 v94.75,19.84 | U2.THERMAL 61.12,15.39 | C30.2 118.98,1.53 118.98,2.95 | 98.69,3.52 98.76,3.52 TP3.P$1 | v81.38,16.18 80.59,16.18 80.47,16.3 | v74.37,9.42 74.14,9.65 | U4.25 73.24,17.77 73.24,17.88 | U3.2 95.38,7.59 95.38,7.57 | Q1.1 67.23,10.33 67.23,9.35 67.26,9.35 67.26,9.02 67.33,9.02 | 67.33,9.02 68.33,9.02 Q1.4 | 67.33,9.02 67.33,8.05 66.8,7.52 CAM1.2_GND | 49.73,3.99 50.31,3.99 C27.2
  Top 0.178: v40.65,2.67 40.62,2.63 40.31,2.63 | U5.4 19.51,5.71 v19.21,5.41 | C31.2 24.59,7.06 v25.43,7.06 | U$3.2 87.81,9.83 87.56,10.08
  Top 0.254: 60.37,5.01 U2.5 60.38,13.61 | 59.16,13.74 U2.42 55.51,13.74 | 63.16,3.5 61.42,3.5 | 61.42,3.5 60.36,3.5 | 61.42,4.1 61.42,3.5 | C13.2 63.56,3.44 63.56,2.08 67.55,2.08 67.55,3.97 C19.2 67.47,3.56 67.48,3.57 C1.2 70.22,3.57 70.39,3.74 | 71.2,4.55 71.1,4.45 | C4.2 71.1,4.45 | U2.THERMAL 61.37,13.24 U2.18 73.49,13.24 73.49,10.64 | 71.1,4.45 70.39,3.74 | 70.39,3.74 70.39,2.29 70.69,1.99 75.65,1.99 75.65,3.51 76.56,4.43 76.56,8.18 73.56,8.18 | 63.84,1.88 63.84,3.67 63.49,3.67 | 55.51,13.74 55.07,13.74 55.07,15.59 C16.2 | 95.38,7.57 95.38,9.17 95.22,10.1 | 95.22,10.13 95.19,10.26 | C20.2 87.77,7.67 R6.1 87.77,5.38 87.76,5.38 v87.76,5.33 | 98.69,3.52 98.69,2.85 87.76,2.85 v87.76,3.63 87.42,3.97 86.24,3.97 86.24,5.71 | 86.24,5.71 C11.2 | 95.22,10.1 95.22,10.32 C8.2 95.55,12.19 95.56,14.76 | 95.23,16.28 95.23,17.21 94.61,17.21 94.61,17.67 | 95.23,16.28 95.56,15.94 95.56,14.76 | 95.23,16.28 94.61,16.89 94.59,17.55 | 95.23,16.28 95.28,16.23 101.94,16.23 J7.1 | 95.56,14.76 96.68,14.75 96.68,14.2 v97.14,14.2 97.14,14.29 | 95.56,14.76 | 73.49,9.02 73.48,9.02 73.48,8.99 | 73.49,9.65 73.49,9.02 | 73.49,10.64 73.49,9.65 | 46.39,16.38 SAT1.21 | SAT1.39 46.39,4.88 | VREG1.P$2 86.24,12.06 86.24,10.08 | 86.24,10.08 86.24,5.71 | C25.2 127.18,10.93 127.18,11.15 | R12.2 124.16,7.39 v124.16,8.38 | v110.62,9.37 110.55,9.45 109.53,9.45 109.53,7.82 108.89,7.82 | VREG1.P$4 81.36,13.02 | 81.36,13.02 80.5,13.02 80.5,13.41 80.45,13.41 | 80.45,14.99 80.45,13.41 | C28.2 20.04,18.09 22.74,17.86 22.74,13.79 21.79,13.79 | 21.79,13.79 17.68,13.79 17.68,12.95 17.24,12.95 17.24,12.82 16.43,12.82 16.43,10.33 | VREG2.P$2 21.79,13.79 | 21.79,13.79 21.79,13.82 22.76,13.82 22.76,15.3 VREG2.P$4 22.74,19.8 C24.2
  Top 0.254: 16.43,10.33 14.34,10.33 C14.2 14.05,10.05 12.88,10.05 | J5.P$1 7.12,1.98 15.98,1.98 16.43,2.43 16.43,10.33 | 12.88,10.05 U6.7 | 12.88,10.05 12.88,9.5 13.29,9.09 13.21,9.02 v13.21,8.97 | C22.2 118.98,2.95 v118.98,3 | C3.2 79.33,13.41 80.45,13.41 | C18.2 73.71,10.64 73.49,10.64 | U3.2 v97.18,7.59 v97.19,7.59 | v81.36,13.92 81.36,13.02 | v55.51,13.99 55.51,13.74 | C21.2 95.22,10.19 95.22,10.1 | U2.35 58.87,15.83 58.88,15.83 58.88,15.39 61.12,15.39 | 74.14,9.65 73.49,9.65 | 87.56,10.08 86.24,10.08 | 73.56,8.18 73.56,6.68 74.14,6.1 | 66.37,1.8 66.42,1.8 | TP3.P$1 97.19,3.76 v97.19,7.59 | J9.6_GND 108.89,7.82 | C29.2 106.72,4.39 108.89,4.39 108.89,7.82 | 73.49,9.02 73.49,8.25 73.56,8.18 | PWRCOMM1.2 101.68,9.25 98.02,9.25 97.19,8.41 v97.19,7.59
  Top 0.305: C9.2 34.77,11.19 U11.5_GND
  Top 0.508: U7.2 114.85,13.96 J3.4 | U8.2 116.54,6.95 116.54,8.81 J3.2 | Q5.2 127.21,1.24 127.21,9.68 127.18,9.68 | Q4.2 127.18,12.94 127.18,11.15 127.18,9.68 | 127.18,9.68 v126.33,9.68 | SW_RST.P$2 54.09,1.8 | 40.65,3 v40.65,2.67
  Top 0.813: 54.09,1.8 66.42,1.8 75.65,1.8 | v66.37,2.34 66.37,1.8 | 40.31,2.63 40.31,4.06 38.34,4.06 C26.2 | 49.71,3.99 49.73,3.99 | SW_RST.P$2 53.76,2.3 52.64,2.3 51.82,2.94 49.73,2.95 | 46.43,2.88 40.88,2.9 v40.65,2.67 | C27.2 50.59,3.95 50.59,3.16 50.58,2.95 47.7,2.96 46.5,2.96 46.43,2.88 | SAT1.39 46.43,4.9 46.43,2.88 | SAT1.21 46.46,16.41 v48.11,16.41
  Bottom 0.254: v87.76,5.33 87.81,5.28 87.81,3.68 v87.76,3.63 | J1.GND3 98.72,12.93 98.38,13.82 97.69,13.82 97.69,13.89 97.72,13.89 97.42,14.2 v97.14,14.2 | 110.98,13.41 112.63,13.41 112.63,13.89 J3.4 | 110.98,13.41 J1.GND1 | J1.GND4 98.72,8.08 98.65,8.16 | J9.6_GND 107.96,7.47 102.48,7.47 101.71,8.24 J1.6 97.83,8.24 v97.19,7.59 | J3.2 114.85,8.99 110.9,8.99 | v124.16,8.38 124.16,8.69 124.16,8.89 | J1.GND2 110.29,5.89 110.29,9.07 110.88,9.07 110.88,9.12 v110.62,9.37 110.39,9.61 110.39,12.82 110.98,13.41 | v13.21,8.97 13.21,8.84 12.12,7.24 6.95,4.43 | J2.8 6.95,4.43 | J5.P$1 6.95,4.43 | v118.98,3 119,8.69 119,8.89 | CON_JTAG1.5 60.36,13.48 60.36,13.08 60.86,13.08 | 60.86,13.08 v60.86,13.17 | CON_JTAG1.3 60.86,12.21 60.86,13.08
  Bottom 0.305: U11.5_GND 31.56,12.73
  Bottom 0.406: v19.18,2.62 19.01,2.44
  Bottom 0.508: v126.33,9.68 126.35,9.65 126.35,8.89 124.16,8.89 | 124.16,8.69 119,8.69 | 119,8.89 114.93,8.89 J3.2 | v40.65,2.67 40.42,2.44 19.01,2.44 | J2.8 6.97,1.68 7.02,2.13 7.1,2.05 17.62,2.05 17.75,1.93 18.98,1.93
  Bottom 0.61: J7.3 107.02,19.61 107.04,19.63 102.16,19.63 101.93,19.41 J7.1
  Bottom 0.813: 40.09,3.94 40.09,2.67 v40.65,2.67 40.95,2.97 46.41,2.97 46.39,2.99 SAT1.39 | SAT1.21 48.03,16.33 v48.11,16.41
  other vias: 87.36,19.81 87.66,17.58 94.6,17.55 57.49,18.06 74.14,6.02 97.62,19.71 85.48,19.79
  pour Bottom: 9.63,16.13 9.63,9.25 9.66,9.22 9.66,6.43 9.63,6.4 19.64,6.4 19.64,16.13 19.67,16.15
  pour Bottom: 17.58,24.49 17.58,-1.32 130.16,-1.32 130.16,24.51 19.51,24.51
  pour Route2: 9.91,22.45 9.91,3.99 6.63,3.99 6.63,-2.95 129.77,-2.95 129.77,22.45 9.93,22.45
IMU_INT  (via drill 0.35)
  Top 0.178: v67.42,18.64 | v67.42,18.64 67.22,17.63 63.65,17.63 63.37,17.35 U2.26 | U4.12 76.59,18.27 76.59,18.59 v76.54,18.64
  Bottom 0.178: v76.54,18.64 76.03,19.15 67.65,19.15 67.42,18.92 v67.42,18.64
IO_PWR
  Top 0.178: U2.12 65.08,10.01 65.08,9.68 Q1.2
LAN
  Top 0.178: 74.5,4.86 74.5,4.74 LED1.A | R7.1 73.06,4.86 74.5,4.86 | 74.5,4.86 74.6,4.86 75.58,5.84 75.58,6.78 U$4.P$1
LED1  (via drill 0.35)
  Top 0.178: U2.39 56.17,15.24 56.17,17.13 54.64,17.51 v54.06,16.82 | v54.66,4.12 52.79,4.12 52.79,6.12 51.34,6.12 51.26,6.19 51.26,8.59 v51.9,9.22 | LED1.C 73.13,2.99 U$4.P$2
  Bottom 0.178: v54.06,16.82 53.88,16.82 53.91,9.55 51.79,9.29 51.79,9.22 v51.9,9.22 | v54.66,4.12 54.68,4.14 72.4,4.14 73.05,3.49 U$4.P$2
LO_CONT  (via drill 0.35)
  Top 0.178: 124.39,1.24 124.39,0.56 113.85,0.56 v113.85,2.18 | U2.29 61.88,18.01 62.44,18.63 63.02,18.72 64.19,19.86 70.39,19.86 70.39,16 v70.19,15.8
  Top 0.254: Q5.1 124.39,1.24
  Bottom 0.178: v113.85,2.18 109.06,2.18 109.06,16.46 108.53,16.69 87.13,16.69 87.13,14.86 70.49,14.86 70.49,15.49 v70.19,15.8
LO_REL  (via drill 0.35)
  Top 0.178: Q4.1 124.08,14.01 122.18,14.01 122.18,20.4 98.86,20.4 98.86,18.59 84.61,18.59 84.61,20.24 72.07,20.24 72.07,20.21 v72.12,20.21 | v62.77,19.51 62.77,19.54 62.58,19.51 61.37,18.19 61.37,18.03 U2.30
  Bottom 0.178: v72.12,20.21 63.45,20.21 62.77,19.53 v62.77,19.51
N$1
  Top 0.178: U2.1 58.37,8.15 57.17,6.97 X1.P$1 57.05,6.27 57.05,5.89 56.01,4.85 C6.2
N$2  (via drill 0.6)
  Top 0.178: v94.39,5 94.34,4.95 94.29,4.95
  Top 0.254: LED2.C 94.29,4.71 94.29,4.95 U3.1
N$3  (via drill 0.6)
  Top 0.178: v91.39,3.76 91.34,3.71 91.34,3.62
  Top 0.254: R5.2 91.06,3.62 91.34,3.62 LED2.A
N$4
  Top 0.254: U3.5 91.56,6.51 R6.2
N$7
  Top 0.178: U1.1 50.83,18.86 50.83,19.36 49.71,19.36 C7.1 | C7.1 | R1.1 C7.1
N$8
  Top 0.178: U2.2 58.87,6.62 X1.P$2 58.63,5.89 59.46,5.06 C5.1
N$11
  Top 0.254: R17.1 125.5,5.85 Q5.3 125.34,3.18 125.34,2.02 123.76,2.02 123.13,1.39 R16.2
N$16
  Top 0.178: U4.10 76.59,17.48 C23.1
PA13
  Top 0.178: U2.22 66.04,15.24 TP4.P$1
PA14
  Top 0.178: U2.23 65.37,15.74 65.91,16.28 67.41,16.28 TP5.P$1
PA15
  Top 0.178: U2.24 65.12,16.76 69.42,16.76 69.42,15.11 77.73,15.11 77.73,9.88 | 77.73,9.88 78.48,9.88 R4.1 | TP6.P$1 77.58,9.73 77.73,9.88
PWR_OFF#
  Top 0.178: VREG1.P$3 84.35,13.02 84.35,9.93 83.77,9.93 | R18.1 83.77,9.83 83.77,9.93 | 83.77,9.93 83.67,9.83 U$3.1
RELOUT_HI
  Top 0.508: 120.79,18 J4.P$1
  Top 0.61: U7.6 120.79,18
RELOUT_LO
  Top 0.254: R17.2 124.79,6.89 124.04,6.89 124.04,6.28 123.46,5.69 R15.2
  Top 0.305: Q4.3 125.03,9.22 125.45,9.22 R17.2
  Top 0.508: Q4.3 125.03,15.09 | 123.3,18 J4.P$2
  Top 0.61: 125.03,15.09 123.3,15.09 123.3,18
RESET#  (via drill 0.35)
  Top 0.178: U2.40 55.61,14.74 55.61,16.51 v55.35,16.51 | SW_RST.P$1 54.09,6.54 53.76,6.87 | 53.76,6.87 53.57,7.06 R3.1 51.89,8.28 52.94,8.28 52.94,8.48 52.99,8.48 v53.04,8.43 | U$5.P$1 53.76,6.87
  Route15 0.178: PWRCOMM1.5 101.65,3.5 99.57,1.42 53.11,1.42 52.45,2.08 52.96,2.59 52.96,6.45 53.31,6.81 53.75,6.81 U$5.P$1
  Bottom 0.178: v53.04,8.43 54.06,8.43 54.46,8.84 54.46,15.62 v55.35,16.51 55.56,16.51 55.56,15.41 60,15.41 60,16.02 CON_JTAG1.10
RXD  (via drill 0.6)
  Top 0.178: U2.16 71.66,12.24 71.66,11.76 v71.58,11.76 | v48.54,15.16 46.49,15.16 SAT1.23
  Bottom 0.178: v71.58,11.76 71.53,11.76 71.53,11.63 71.53,11.91 69.88,11.91 69.88,5.49 49.53,5.49 49.53,15.16 v48.54,15.16 46.49,15.16 SAT1.23
SCL  (via drill 0.35, 0.5)
  Top 0.178: 60.37,20.52 60.37,20.55 71.1,20.55 71.1,16.67 U4.23 | 60.37,20.52 U2.32 | 60.37,20.52 52.63,20.52 52.63,18.86 U1.6 51.75,18.91 51.75,16.33 50.87,16.33 | 33.33,18.05 33.33,18.06 v33.33,18.09 33.33,17.11 33.43,17.02 33.91,17.02 | 50.87,16.33 50.87,17.3 34.34,17.3 34.06,17.02 33.91,17.02 | 50.87,16.33 R8.1 | U11.4_SCL 31.66,10.09 31.66,11.8 33.91,14.05 33.91,17.02 | U5.5 24.66,5.56 28.07,5.56 v28.12,5.61
  Bottom 0.178: v28.12,5.61 30.99,5.61 32.74,7.37 32.36,7.74 U11.4_SCL
SD_CS  (via drill 0.35, 0.38)
  Top 0.178: v65.72,18.59 65.33,18.19 63.7,18.19 62.87,17.35 U2.27 | v82.58,15.88 82.58,15.52 83.15,14.95 83.11,14.91 v83.11,14.07 | J9.2_CS J9.P2
  Bottom 0.178: 103.92,12.59 100.77,12.59 J1.2 | 103.92,12.59 102.22,12.59 102.22,15.11 96.02,15.11 96.02,14.1 86.32,14.1 86.29,14.07 v83.11,14.07 | J9.2_CS 107.64,12.59 103.92,12.59 | v65.72,18.59 65.72,19.53 83.88,19.53 83.88,18.11 86.67,18.11 86.67,15.6 83.11,15.6 82.84,15.88 v82.58,15.88
SD_MISO  (via drill 0.35)
  Top 0.178: U2.21 76.38,14.74 76.43,14.69 76.43,11.61 75.77,10.95 75.77,9.25 76.28,8.74 76.78,8.74 77.65,7.87 77.65,7.37 81.77,7.37 v82.12,7.72 | J9.P7 J9.7_DO
  Bottom 0.152: 89.34,8.23 83.26,8.23 82.75,7.72 v82.12,7.72
  Bottom 0.178: 89.34,8.23 89.34,10.69 90.35,10.69 90.35,10.7 95.59,10.7 95.59,5.21 102.14,5.21 102.14,7.07 | J1.7 100.85,7.14 100.85,7.19 101.05,7.19 101.17,7.07 102.14,7.07 | 102.14,7.07 105.14,7.07 105.14,6.45 107.96,6.45 J9.7_DO
SD_MOSI  (via drill 0.35)
  Top 0.178: U2.19 74.71,13.74 74.71,11.56 75.27,11.56 v75.27,11.46 | J9.3_DI J9.P3
  Bottom 0.178: J9.3_DI 105.21,11.63 104.67,12.18 102.6,12.18 101.96,11.54 J1.3 99.32,11.54 99.32,10.34 97.8,10.34 97.8,11.51 96.6,11.51 75.27,11.51 v75.27,11.46
SD_SCK  (via drill 0.35)
  Top 0.178: U2.20 75.78,14.24 75.78,12.8 v75.55,12.57 | J9.P5 J9.5_SCK
  Bottom 0.178: J9.5_SCK 105.52,9.09 105.52,9.62 101.94,9.62 101.66,9.34 J1.5 97.39,9.34 97.39,11.07 79.36,11.07 79.36,10.74 74.3,10.74 74.3,12.6 75.52,12.6 v75.55,12.57
SDA  (via drill 0.35, 0.38)
  Top 0.178: 60.87,19 60.87,20.22 70.72,20.22 70.72,16.27 U4.24 | 60.87,19 U2.31 | R9.1 52.52,13.77 53.07,13.77 53.07,17.91 | v53.53,19.13 53.17,18.76 53.17,17.91 53.07,17.91 | v61.6,19.53 61.07,19 60.87,19 | U1.4 53.07,17.91 | v44.22,19.38 30.68,19.38 29.41,18.11 29.41,10.04 U11.2_SDA 26.02,9.39 25.02,10.39 24.61,10.39 v24.51,10.49 | v19.38,11.23 19.51,11.1 U5.1
  Bottom 0.178: v61.6,19.53 60.92,20.22 53.53,20.22 v53.53,19.13 52.59,20.07 44.3,20.07 44.3,19.46 v44.22,19.38 | v24.51,10.49 20.14,10.49 19.3,11.33 19.3,11.3 v19.38,11.23
SHLD1  (via drill 0.35)
  Top 0.254: U6.1 6.53,11.55 6.52,12.29 6.37,12.36 5.79,12.94 5.73,12.97 5.77,13.18 v5.92,12.95 5.21,13.67 3.82,18.36 3.61,19.28 J2.1 | v3.73,11.77 3.95,11.63 5.12,11.29 3.83,13.06 2.03,13.72 J2.3
  Bottom 0.254: v5.92,12.95 3.97,12.01 v3.73,11.77
  pour Bottom: 7.93,11.05 0.31,11.02 0.26,20.24 7.98,20.22
SHLD2  (via drill 0.35)
  Top 0.254: U6.6 11.72,8.84 11.69,8.81 11.74,8.76 v11.74,8.53 | J2.5 2.47,8.08 5.11,10.03 5.24,10.06 v3.61,9.75 | J2.7 5.66,8.14 v7.4,8.14
  Bottom 0.254: v11.74,8.53 8.01,8.53 7.55,8.08 v7.4,8.14 v3.61,9.75
  pour Bottom: 0.26,3.45 2.75,3.43 7.91,6.02 7.86,10.54 0.23,10.39 0.26,9.93
SW_SCL  (via drill 0.5)
  Top 0.178: J5.P$4 14.74,6.55 10.78,6.55 10.78,11.05 U6.9 12.57,11.05 12.65,11.12 12.65,13.89 12.7,13.95 15.7,13.95 15.7,15 R14.1 | U5.6 21.54,8.38 21.51,8.41 21.23,8.13 21.23,4.93 20.93,4.62 v20.93,3.76
  Bottom 0.178: v20.93,3.76 20.8,3.89 14.8,3.89 J5.P$4
SW_SDA  (via drill 0.5)
  Top 0.178: J5.P$3 10.7,3.82 10.7,5.82 10.29,5.82 10.29,11.46 10.39,11.55 U6.10 11.72,14.77 12,15.05 R13.1 | U5.2 18.44,8.89 18.34,8.79 v18.02,8.79
  Bottom 0.178: v18.02,8.79 14.96,8.79 12.04,5.87 12.2,5.71 J5.P$3
SWCLK  (via drill 0.35)
  Top 0.178: U2.45 55.48,12.24 55.48,12.12 55.35,12.12 v55.35,11.97
  Bottom 0.178: v55.35,11.97 56.41,11.97 56.41,14.13 61.6,14.13 61.6,12.22 CON_JTAG1.4
SWDIO  (via drill 0.35)
  Top 0.178: U2.46 56.27,11.73 v55.33,10.79
  Bottom 0.178: CON_JTAG1.2 60.69,10.94 60.69,11.55 60,11.55 56.12,11.55 56.12,11.2 55.73,11.2 v55.33,10.79
TXD  (via drill 0.6)
  Top 0.178: U2.15 70.67,11.74 70.67,10.78 v70.84,10.61 | v48.59,13.72 48.56,13.74 SAT1.25
  Bottom 0.178: SAT1.25 46.39,13.82 46.39,13.72 v48.59,13.72 48.89,13.42 48.87,13.34 48.83,5 70.59,5 70.59,10.61 v70.84,10.61
USB_D+  (via drill 0.35)
  Top 0.178: U2.34 59.37,17.77 58.86,18.06 58.17,18.77 58.22,18.82 v58.4,18.82 | R23.1 87.38,12.31 87.38,14.94 85.88,14.94 85.88,16.66 v85.86,16.69
  Bottom 0.178: v85.86,16.69 85.98,16.82 85.98,17.55 60.63,17.55 60.63,19.28 58.35,19.28 58.35,18.87 v58.4,18.82
USB_D-  (via drill 0.35)
  Top 0.178: v84.67,16.69 85,16.36 85,14.25 86.92,14.25 86.92,11.53 92.09,11.53 R24.1 | U2.33 59.87,18.47 59.63,18.47 v59.63,18.56
  Bottom 0.178: v84.67,16.69 84.67,16.97 U2.33 59.87,18.16 59.63,18.41 v59.63,18.56
VBAT  (via drill 0.6)
  Top 0.152: 103.61,13.72 PWRCOMM1.1
  Top 0.178: C22.1 117.02,4.83 | R18.2 85.56,9.91 85.48,9.91
  Top 0.254: U3.3 93.83,9.35 93.67,9.97 93.67,9.98 93.57,9.98 | 93.57,9.98 91.42,9.98 v91.14,9.7 | VREG1.P$1 85.48,11.12 85.48,9.91 85.48,7.32 85.27,7.32 v85.27,7.39 | VREG2.P$1 20.48,12.12 17.1,12.12 17.1,1.22 v17.23,1.09 | C21.1 93.57,9.98
  Top 0.305: J7.2 104.55,17.94 104.55,16.43 103.61,15.49 103.61,14.61 103.61,13.72
  Top 0.508: J3.1 114.85,4.83 117.02,4.83 119.51,4.83 119.51,7.89 U8.1
  Top 0.61: J7.2 104.48,19.63 109.56,19.63 J7.4
  Bottom 0.178: 114.85,4.5 114.85,4.85
  Bottom 0.254: v91.14,9.7 91.14,9.09 91.22,9.09 91.22,7.52 85.27,7.52 v85.27,7.39 | v17.23,1.09 17.23,0.66
  Bottom 0.305: J3.1
  Bottom 0.406: J7.4 109.56,4.5 114.85,4.5
  Bottom 0.508: 85.63,0.86 83.95,0.86 83.75,0.66 17.23,0.66 | 114.85,4.85 115.56,4.14 115.56,0.64 85.63,0.64 85.63,0.86 | 85.63,0.86 85.63,7.39 v85.27,7.39
  Bottom 0.762: 114.85,4.85 J3.1
VBAT_SW  (via drill 0.5, 0.6)
  Top 0.178: C26.1 37.96,0.9 37.73,0.9
  Top 0.254: C25.1 124.24,11.84 119.97,11.84 U9.1
  Top 0.508: 119.51,14.9 U7.1 117.58,14.9 117.58,15.49 | U9.1 119.51,11.72 119.51,11.59 | 37.73,0.9 37.73,0.75
  Top 0.61: 119.51,14.9 119.51,11.72
  Top 0.813: R11.1 119.51,11.59 | 117.58,15.49 112.58,15.49 112.58,0.75 47.98,0.75 | 47.98,0.75 37.73,0.75 | 37.73,0.9 37.52,0.9 34.72,0.9 34.72,6.12 39.91,6.15 | SAT1.38 39.91,6.15 | v39.88,6.86 39.88,6.18 39.91,6.15 | 48.11,6.17 48.13,6.15 48.13,4.09 48.16,4.06 48.21,4.06 v48.23,4.09 | 47.98,0.75 48.01,0.78 v48.01,1.77 48.62,1.16 C27.1 | SAT1.37 48.11,6.17 | v48.09,6.17 | v48.09,6.17 48.11,6.17
  Bottom 0.813: SAT1.38 39.88,6.17 39.8,6.25 39.8,7.06 39.8,6.93 v39.88,6.86 | v48.23,4.09 48.23,2.08 47.95,1.8 47.98,1.77 v48.01,1.77 | SAT1.37 48.13,6.17 v48.09,6.17 | v48.09,6.17
VBATSW_EN  (via drill 0.35)
  Top 0.178: v72.22,7.47 72.37,7.62 72.37,9.79 69.7,9.79 69.7,11.24 U2.14 | v79.46,3.07 79.36,2.97 79.36,1.46 110.52,1.46 110.52,7.72 111.18,7.72 v111.18,7.95 | v116.69,5.84 118.17,5.84 U8.3
  Bottom 0.178: v72.22,7.47 72.88,8.13 80.98,8.13 80.98,3.43 80.78,3.23 79.61,3.23 v79.46,3.07 | v111.18,7.95 111.61,7.52 116.69,7.52 v116.69,5.84
VBATX  (via drill 0.35)
  Top 0.178: R11.2 115.95,9.89 115.95,9.92 115.88,9.92 115.88,10.11 113.42,10.11 113.42,4.88 v114.61,3.68 | v86.54,3.2 86.27,2.92 81.72,2.92 81.72,6.02 82.56,6.02 R2.2
  Top 0.508: U9.2 119.97,9.89 120.76,9.89 U8.6
  Top 0.813: R11.2 119.97,9.89
  Bottom 0.178: v114.61,3.68 114.79,3.5 114.79,1.51 87.31,1.51 87.31,2.72 87.03,2.72 v86.54,3.2
VBUS
  Top 0.178: C8.1 94.2,11.94 | J11.P$4 94.34,15.19 94.16,15.19 | J6.VBUS1 92.34,16.74 92.33,16.74
  Top 0.254: U3.4 90.48,8.55 | 90.48,8.55 89.19,8.56 89.19,8.84 | 90.48,8.55 89.95,8.02 C20.1 | 89.19,8.84 86.7,8.84 86.7,4.5 89.75,4.5 R5.1 | 89.19,8.84 89.19,9.22 89.19,10.54 89.68,10.54 89.68,11.1 93.61,11.1 93.61,11.94 94.16,11.94 | 92.33,16.74 92.33,16.36 94.16,16.36 94.16,15.19 94.16,11.94 | 94.2,11.94 94.16,11.94
VDDA
  Top 0.178: C13.1 63.18,5.12 | L1.1 65.49,5.27
  Top 0.254: 63.18,5.12 C12.1 61.4,5.23 60.87,5.76 U2.6 | 65.49,5.27 C13.1
VDDCORE
  Top 0.254: U2.43 54.57,13.24 54.57,14.54 54.11,14.54 C16.1
VHF  (via drill 0.6)
  Top 0.178: U2.48 57.54,10.63 57.54,8.97 57.44,8.87 56.93,8.87 56.88,8.82 v56.95,8.74

### Text on the board
tNames: SAT1 | - | + | - | + | - | - | + | iSea Solutions CamTag, evolved from DeepWhaleSharkTag, iTag | Thom Maughan Jan 2019
Document: CamTag controller / Based on DeepTag 4500m by iSee Soln / Based on iTag by Loggerhead / Design by Thom Maughan / Jun 2019